# Altium schematic sheet 电源电路原理图.SchDoc
size A4
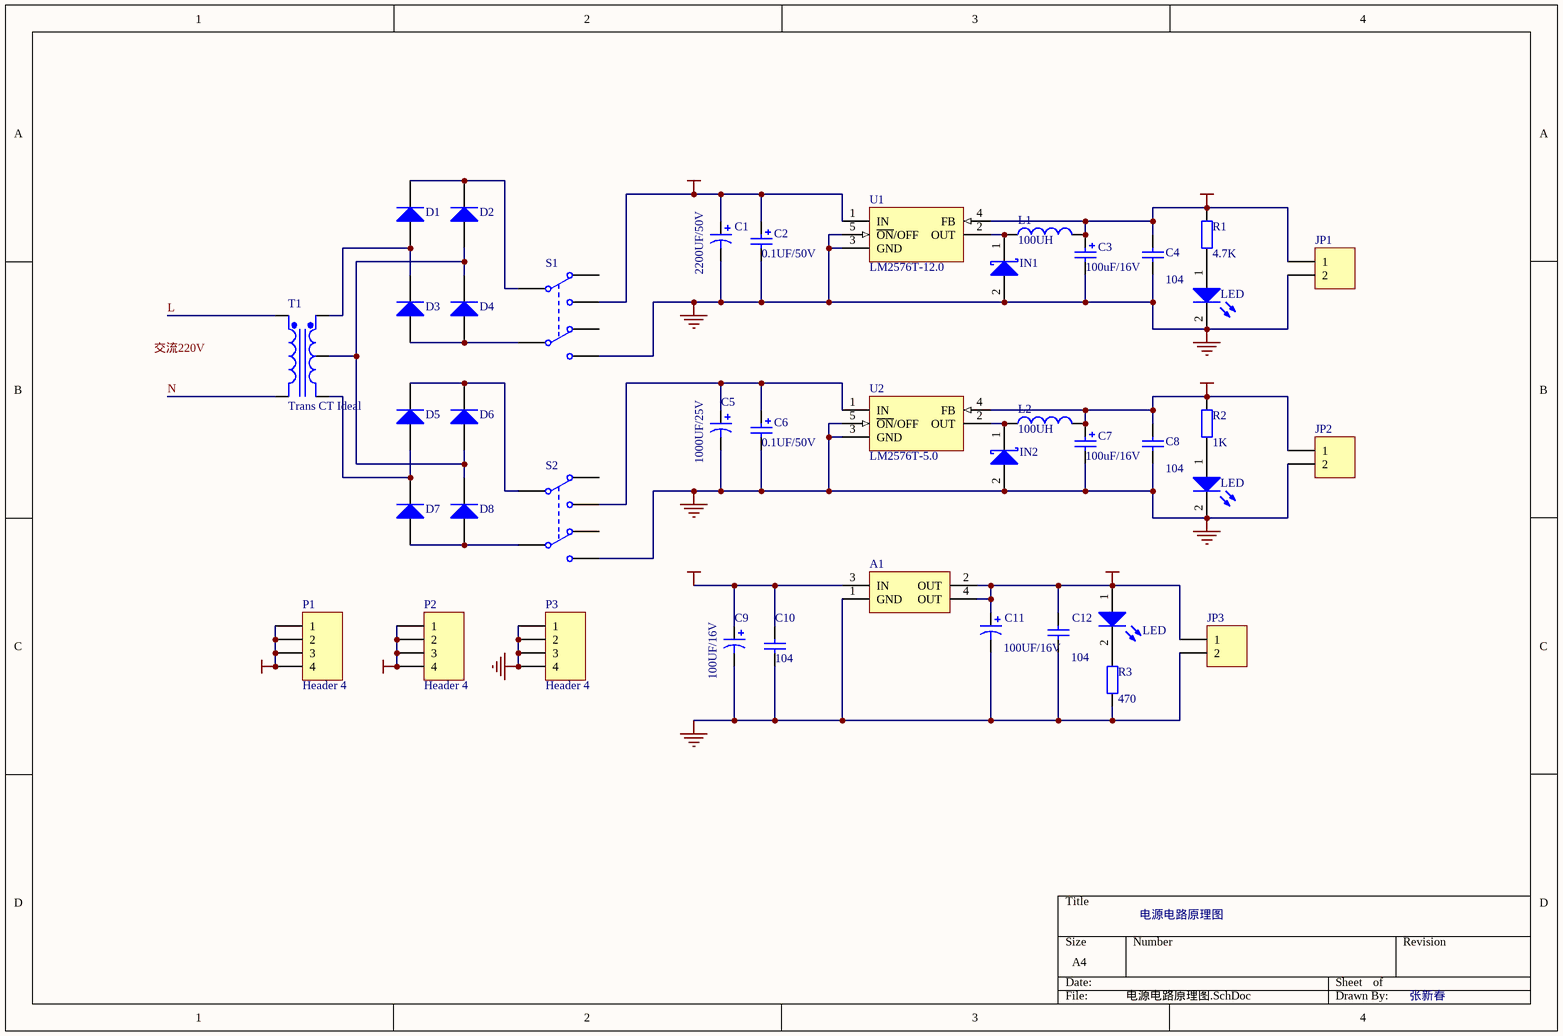
[diagram p0: 电源电路原理图.SchDoc]

## Parts
A1  REG1117-3.3  [ZZ311]  (value not drawn)
C1  value 2200UF/50V  [C-DJ-6]  (hidden comment: Cap Pol1)
C2  value 0.1UF/50V  [C-DJ-6]  (hidden comment: DJDR)
C3  value 100uF/16V  [C-DJ-6]  (hidden comment: DJDR)
C4  value 104  [CPDR]  (hidden comment: CPDR)
C5  value 1000UF/25V  [C-DJ-6]  (hidden comment: Cap Pol1)
C6  value 0.1UF/50V  [C-DJ-6]  (hidden comment: DJDR)
C7  value 100uF/16V  [C-DJ-6]  (hidden comment: DJDR)
C8  value 104  [CPDR]  (hidden comment: CPDR)
C9  value 100UF/16V  [C-DJ-6]  (hidden comment: Cap Pol1)
C10  value 104  [CPDR]  (hidden comment: Cap Semi)
C11  value 100UF/16V  [C-DJ-4]  (hidden comment: Cap Pol1)
C12  value 104  [CPDR]  (hidden comment: Cap Semi)
D1  (no value)  [DIO10.46-5.3x2.8]
D2  (no value)  [DIO10.46-5.3x2.8]
D3  (no value)  [DIO10.46-5.3x2.8]
D4  (no value)  [DIO10.46-5.3x2.8]
D5  (no value)  [DIO10.46-5.3x2.8]
D6  (no value)  [DIO10.46-5.3x2.8]
D7  (no value)  [DIO10.46-5.3x2.8]
D8  (no value)  [DIO10.46-5.3x2.8]
DS1  LED  [LED_D]
DS2  LED  [LED_D]
DS3  LED  [LED]
IN1  WY2JG  [ZCDZL]  (value not drawn)
IN2  WY2JG  [ZCDZL]  (value not drawn)
JP1  PZ_2  [JIKEKE]  (value not drawn)
JP2  PZ_2  [JIKEKE]  (value not drawn)
JP3  PZ_2  [JIKEKE]  (value not drawn)
L1  value 100UH  [L_DG]  (hidden comment: DG)
L2  value 100UH  [L_DG]  (hidden comment: DG)
P1  Header 4  [HDR1X4]
P2  Header 4  [HDR1X4]
P3  Header 4  [HDR1X4]
R1  value 4.7K  [RSE]  (hidden comment: Res)
R2  value 1K  [RSE]  (hidden comment: Res)
R3  value 470  [TP-0805-R]  (hidden comment: Res)
S1  (no value)  [DPDT-6]
S2  (no value)  [DPDT-6]
T1  Trans CT Ideal  [T]
U1  LM2576T-12.0  [T05A]
U2  LM2576T-5.0  [T05A]

## Nets
+3.3V: A1.2(OUT) A1.4(OUT) C11.1 C12.2 DS3.1(A) JP3.1
+5V: A1.3(IN) C7.1 C8.2 C9.1 C10.2 JP2.1 L2.2 P2.1 P2.2 P2.3 P2.4 R2.2 U2.4(FB)
+12V: C3.1 C4.2 JP1.1 L1.2 P1.1 P1.2 P1.3 P1.4 R1.2 U1.4(FB)
AGND: P3.1 P3.2 P3.3 P3.4
GND: A1.1(GND) C1.2 C2.2 C3.2 C4.1 C5.2 C6.2 C7.2 C8.1 C9.2 C10.1 C11.2 C12.1 DS1.2(K) DS2.2(K) IN1.2(K) IN2.2(K) JP1.2 JP2.2 JP3.2 R3.1 S1.6(NO2) S2.6(NO2) U1.3(GND) U1.5(~{ON}/OFF) U2.3(GND) U2.5(~{ON}/OFF)
VCC: C1.1 C2.1 S1.3(NO1) U1.1(IN)
L: T1.1(Pri+)
N: T1.2(Pri-)
NetC5_1: C5.1 C6.1 S2.3(NO1) U2.1(IN)
NetD1_1: D1.1(A) D3.2(K) T1.3(Sec+)
NetD1_2: D1.2(K) D2.2(K) S1.1(COMMON1)
NetD2_1: D2.1(A) D4.2(K) D6.1(A) D8.2(K) T1.4(SecCT)
NetD3_1: D3.1(A) D4.1(A) S1.5(COMMON2)
NetD5_1: D5.1(A) D7.2(K) T1.5(Sec-)
NetD5_2: D5.2(K) D6.2(K) S2.1(COMMON1)
NetD7_1: D7.1(A) D8.1(A) S2.5(COMMON2)
NetDS1_1: DS1.1(A) R1.1
NetDS2_1: DS2.1(A) R2.1
NetDS3_2: DS3.2(K) R3.2
NetIN1_1: IN1.1(A) L1.1 U1.2(OUT)
NetIN2_1: IN2.1(A) L2.1 U2.2(OUT)

Not connected (* = marked no-connect by the designer): S1 2(NC1) 4(NC2); S2 2(NC1) 4(NC2)

## Notes on the sheet
- 电源电路原理图
- 张新春
- Labels drawn without touching a wire or pin: 交流220V

## Library data of the parts
A1 = REG1117-3.3: 800mA and 1A Low Dropout Positive Regulator 2.85V, 3.3V, 5V, and Adjustable; PackageDocument: revC; Published: 8-Jun-2000; LatestRevisionDate: 17-Jul-2002; LatestRevisionNote: Re-released for DXP Platform.; DatasheetDocument: Sep-1997; PackageReference: ZZ311; Publisher: Altium Limited
C1 C5 C9 C11 = Cap Pol1: Polarized Capacitor (Radial); Published: 8-Jun-2000; LatestRevisionDate: 17-Jul-2002; LatestRevisionNote: Re-released for DXP Platform.; Publisher: Altium Limited
C2 C3 C6 C7 = DJDR: 电解电容; Published: 8-Jun-2000; LatestRevisionDate: 17-Jul-2002; LatestRevisionNote: Re-released for DXP Platform.; Publisher: Altium Limited
C4 C8 = CPDR: 瓷片电容; Published: 8-Jun-2000; LatestRevisionDate: 17-Jul-2002; LatestRevisionNote: Re-released for DXP Platform.; Publisher: Altium Limited
C10 C12 = Cap Semi: Capacitor (Semiconductor SIM Model); Published: 8-Jun-2000; LatestRevisionDate: 17-Jul-2002; LatestRevisionNote: Re-released for DXP Platform.; PackageReference: C1206; Publisher: Altium Limited
D1-D8 = Diode 1N4007: 1 Amp General Purpose Rectifier; Published: 8-Jun-2000; LatestRevisionDate: 17-Jul-2002; LatestRevisionNote: Re-released for DXP Platform.; DatasheetDocument: 1998; PackageDocument: Aug-1999; PackageReference: DO-41; Publisher: Altium Limited; Code_JEDEC: DO-204-AL
DS1-DS3 = LED: 发光二极管; Published: 8-Jun-2000; LatestRevisionDate: 17-Jul-2002; LatestRevisionNote: Re-released for DXP Platform.; Publisher: Altium Limited
IN1 IN2 = WY2JG: 稳压二级管; Published: 8-Jun-2000; LatestRevisionDate: 17-Jul-2002; LatestRevisionNote: Re-released for DXP Platform.; Publisher: Altium Limited; Code_JEDEC: DO-214-AA
JP1-JP3 = PZ_2: 排针——2; LatestRevisionDate: 17-Jul-2002; LatestRevisionNote: Re-released for DXP Platform.; Publisher: Altium Limited
L1 L2 = DG: 电感; Code_IEC: 1005; Published: 8-Jun-2000; LatestRevisionDate: 17-Jul-2002; LatestRevisionNote: Re-released for DXP Platform.; PackageReference: 0402-A; Publisher: Altium Limited; Code_JEITA: 0402
P1-P3 = Header 4: Header, 4-Pin; LatestRevisionDate: 17-Jul-2002; LatestRevisionNote: Re-released for DXP Platform.; Publisher: Altium Limited
R1-R3 = Res: 电阻; Published: 8-Jun-2000; LatestRevisionDate: 17-Jul-2002; LatestRevisionNote: Re-released for DXP Platform.; Publisher: Altium Limited
S1 S2 = SW DPDT: Switch; Published: 24-Mar-1999; LatestRevisionDate: 17-Jul-2002; LatestRevisionNote: Re-released for DXP Platform.; Publisher: Altium Limited
T1 = Trans CT Ideal: Center-Tapped Transformer (Ideal); Published: 8-Jun-2000; LatestRevisionDate: 17-Jul-2002; LatestRevisionNote: Re-released for DXP Platform.; Publisher: Altium Limited
U1 U2 = LM2576HVT-3.3: Simple Switcher 3A Step Down Voltage Regulator; PackageDocument: 2000; Note: Tab is connected to GND; Published: 15-Apr-2002; DatasheetDocument: Jun-1999; PackageReference: T05A; Publisher: Altium Limited; Code_JEDEC: TS-001-AA; ComponentLink1Description: Manufacturer Link; ComponentLink1URL: http://www.national.com/